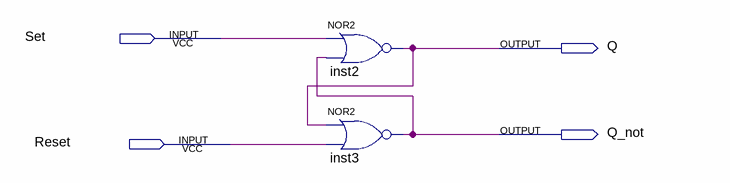
[diagram p0: schematic sheet]
// Quartus schematic SR-Latch.bdf as structural Verilog: 2 symbols, 4 pins
module \SR-Latch  (
  input  Set,
  input  Reset,
  output Q,
  output Q_not
);

  nor inst2 (Q, Set, Q_not);
  nor inst3 (Q_not, Q, Reset);
endmodule
